# EAGLE schematic bms_slave (EAGLE 7.5.0)
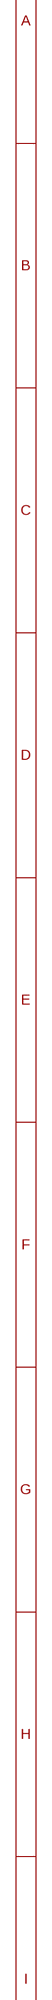
[diagram p0: schematic, sheet 1, part 1 of 2]
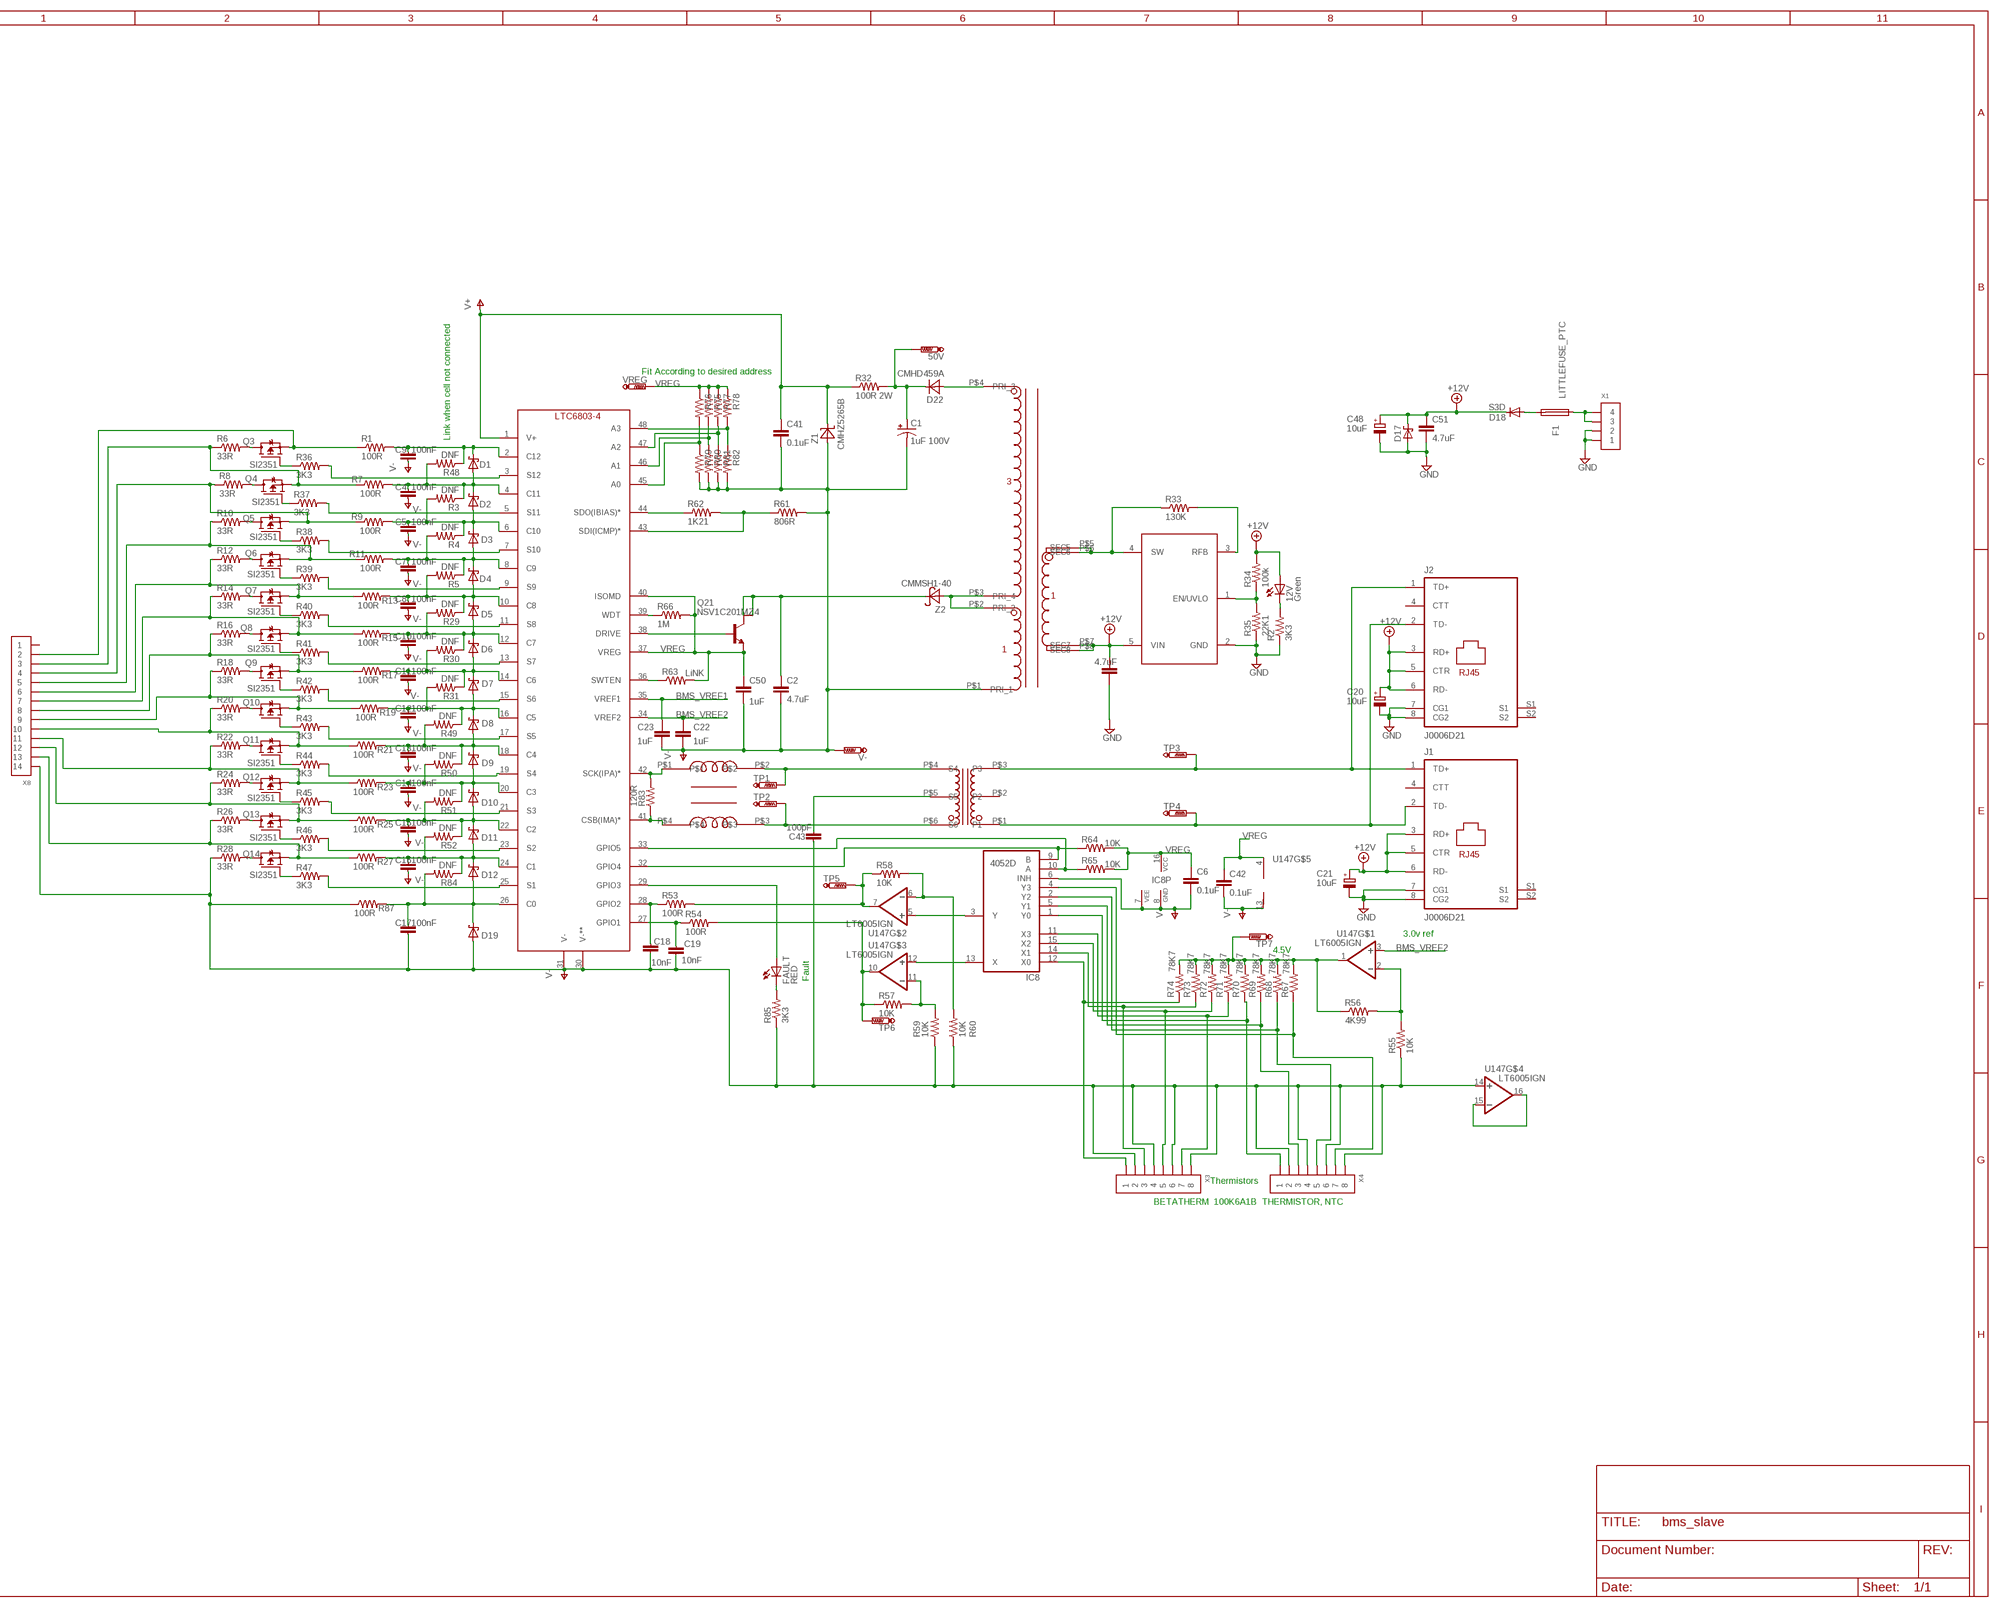
[diagram p1: schematic, sheet 1, part 2 of 2]

## Parts
12V  Green  LEDCHIP-LED0805  [CHIP-LED0805]
50V  PTR1PAD1-13  [P1-13]
C1  1uF 100V  CPOL-USSMCD  [SMC_D]
C2  4.7uF  C-EUC1206  [C1206]
C3  4.7uF  C-EUC1206  [C1206]
C4  100nF  C-EU-SMALL_0603  [C0603@1]
C5  100nF  C-EU-SMALL_0603  [C0603@1]
C6  0.1uF  C-EUC1206  [C1206]
C7  100nF  C-EU-SMALL_0603  [C0603@1]
C8  100nF  C-EU-SMALL_0603  [C0603@1]
C9  100nF  C-EU-SMALL_0603  [C0603@1]
C10  100nF  C-EU-SMALL_0603  [C0603@1]
C11  100nF  C-EU-SMALL_0603  [C0603@1]
C12  100nF  C-EU-SMALL_0603  [C0603@1]
C13  100nF  C-EU-SMALL_0603  [C0603@1]
C14  100nF  C-EU-SMALL_0603  [C0603@1]
C15  100nF  C-EU-SMALL_0603  [C0603@1]
C16  100nF  C-EU-SMALL_0603  [C0603@1]
C17  100nF  C-EU-SMALL_0603  [C0603@1]
C18  10nF  C-EU-SMALL_0603  [C0603@1]
C19  10nF  C-EU-SMALL_0603  [C0603@1]
C20  10uF  CPOL-EUSMCD  [SMC_D]
C21  10uF  CPOL-EUSMCD  [SMC_D]
C22  1uF  C-EUC1206  [C1206]
C23  1uF  C-EUC1206  [C1206]
C41  0.1uF  C-EUC1206  [C1206]
C42  0.1uF  C-EUC1206  [C1206]
C43  100pF  C-EU-SMALL  [C1206@1]
C48  10uF  CPOL-EUSMCD  [SMC_D]
C50  1uF  C-EUC1206  [C1206]
C51  4.7uF  C-EUC1206  [C1206]
D1  SMF5.0AT1  [SOD123FL]
D2  SMF5.0AT1  [SOD123FL]
D3  SMF5.0AT1  [SOD123FL]
D4  SMF5.0AT1  [SOD123FL]
D5  SMF5.0AT1  [SOD123FL]
D6  SMF5.0AT1  [SOD123FL]
D7  SMF5.0AT1  [SOD123FL]
D8  SMF5.0AT1  [SOD123FL]
D9  SMF5.0AT1  [SOD123FL]
D10  SMF5.0AT1  [SOD123FL]
D11  SMF5.0AT1  [SOD123FL]
D12  SMF5.0AT1  [SOD123FL]
D17  SCHOTTKY-DIODESMC  [SMC]
D18  S3D  DIODE-SMC  [SMC]
D19  SMF5.0AT1  [SOD123FL]
D22  CMHD459A  [SOD123]
F1  LITTLEFUSE_PTC  [1812]
FAULT  RED  LEDCHIP-LED0805  [CHIP-LED0805]
IC8  4052D  [SO16]
J1  J0006D21  [J0-C/D/E]
J2  J0006D21  [J0-C/D/E]
Q3  SI2351  [SOT23]
Q4  SI2351  [SOT23]
Q5  SI2351  [SOT23]
Q6  SI2351  [SOT23]
Q7  SI2351  [SOT23]
Q8  SI2351  [SOT23]
Q9  SI2351  [SOT23]
Q10  SI2351  [SOT23]
Q11  SI2351  [SOT23]
Q12  SI2351  [SOT23]
Q13  SI2351  [SOT23]
Q14  SI2351  [SOT23]
Q21  NSV1C201MZ4  [SOT223]
R1  100R  R-US_R0603  [R0603]
R2  3K3  R-US_R0603  [R0603]
R3  DNF  R-US_R0603  [R0603]
R4  DNF  R-US_R0603  [R0603]
R5  DNF  R-US_R0603  [R0603]
R6  33R  R-US_R2512  [R2512]
R7  100R  R-US_R0603  [R0603]
R8  33R  R-US_R2512  [R2512]
R9  100R  R-US_R0603  [R0603]
R10  33R  R-US_R2512  [R2512]
R11  100R  R-US_R0603  [R0603]
R12  33R  R-US_R2512  [R2512]
R13  100R  R-US_R0603  [R0603]
R14  33R  R-US_R2512  [R2512]
R15  100R  R-US_R0603  [R0603]
R16  33R  R-US_R2512  [R2512]
R17  100R  R-US_R0603  [R0603]
R18  33R  R-US_R2512  [R2512]
R19  100R  R-US_R0603  [R0603]
R20  33R  R-US_R2512  [R2512]
R21  100R  R-US_R0603  [R0603]
R22  33R  R-US_R2512  [R2512]
R23  100R  R-US_R0603  [R0603]
R24  33R  R-US_R2512  [R2512]
R25  100R  R-US_R0603  [R0603]
R26  33R  R-US_R2512  [R2512]
R27  100R  R-US_R0603  [R0603]
R28  33R  R-US_R2512  [R2512]
R29  DNF  R-US_R0603  [R0603]
R30  DNF  R-US_R0603  [R0603]
R31  DNF  R-US_R0603  [R0603]
R32  100R 2W  R-US_R2512  [R2512]
R33  130K  R-US_R0603  [R0603]
R34  100k  R-US_R0603  [R0603]
R35  22K1  R-US_R0603  [R0603]
R36  3K3  R-US_R0603  [R0603]
R37  3K3  R-US_R0603  [R0603]
R38  3K3  R-US_R0603  [R0603]
R39  3K3  R-US_R0603  [R0603]
R40  3K3  R-US_R0603  [R0603]
R41  3K3  R-US_R0603  [R0603]
R42  3K3  R-US_R0603  [R0603]
R43  3K3  R-US_R0603  [R0603]
R44  3K3  R-US_R0603  [R0603]
R45  3K3  R-US_R0603  [R0603]
R46  3K3  R-US_R0603  [R0603]
R47  3K3  R-US_R0603  [R0603]
R48  DNF  R-US_R0603  [R0603]
R49  DNF  R-US_R0603  [R0603]
R50  DNF  R-US_R0603  [R0603]
R51  DNF  R-US_R0603  [R0603]
R52  DNF  R-US_R0603  [R0603]
R53  100R  R-US_R0603  [R0603]
R54  100R  R-US_R0603  [R0603]
R55  10K  R-US_R0603  [R0603]
R56  4K99  R-US_R0603  [R0603]
R57  10K  R-US_R0603  [R0603]
R58  10K  R-US_R0603  [R0603]
R59  10K  R-US_R0603  [R0603]
R60  10K  R-US_R0603  [R0603]
R61  806R  R-US_R0603  [R0603]
R62  1K21  R-US_R0603  [R0603]
R63  LiNK  R-US_R0603  [R0603]
R64  10K  R-US_R0603  [R0603]
R65  10K  R-US_R0603  [R0603]
R66  1M  R-US_R0603  [R0603]
R67  78K7  R-US_R0603  [R0603]
R68  78K7  R-US_R0603  [R0603]
R69  78K7  R-US_R0603  [R0603]
R70  78K7  R-US_R0603  [R0603]
R71  78K7  R-US_R0603  [R0603]
R72  78K7  R-US_R0603  [R0603]
R73  78K7  R-US_R0603  [R0603]
R74  78K7  R-US_R0603  [R0603]
R75  R-US_R0603  [R0603]
R76  R-US_R0603  [R0603]
R77  R-US_R0603  [R0603]
R78  R-US_R0603  [R0603]
R79  R-US_R0603  [R0603]
R80  R-US_R0603  [R0603]
R81  R-US_R0603  [R0603]
R82  R-US_R0603  [R0603]
R83  120R  R-US_R0603  [R0603]
R84  DNF  R-US_R0603  [R0603]
R85  3K3  R-US_R0603  [R0603]
R87  100R  R-US_R0603  [R0603]
TP1  PTR1PAD1-13  [P1-13]
TP2  PTR1PAD1-13  [P1-13]
TP3  PTR1PAD1-13  [P1-13]
TP4  PTR1PAD1-13  [P1-13]
TP5  PTR1PAD1-13  [P1-13]
TP6  PTR1PAD1-13  [P1-13]
TP7  PTR1PAD1-13  [P1-13]
U1  LTC6804-2  [SSOP48]
U21  LT8300  [TSOT23-5]
U147  LT6005IGN  [TSSOP16]
U$1  DLW43SH510XK2  [DLW43S]
U$3  T3001NL  [T3001NL]
U$15  WURTH_750370040  [WE_750370040]
V-  PTR1PAD1-13  [P1-13]
VREG  PTR1PAD1-13  [P1-13]
X1  CONN_4-1-53261  [PB-53261-04]
X3  CONN_8-1-53261  [PB-53261-08]
X4  CONN_8-1-53261  [PB-53261-08]
X8  CONN_14-1-53261  [PB-53261-14]
Z1  CMHZ5265B  [SOD123]
Z2  CMMSH1-40  [SOD123]

## Nets
+12V [POWER_12V]: 12V.A C3.1 C20.+ C21.+ C48.+ C51.1 D17.C D18.C J1.3(RD+) J1.5(CTR) J1.6(RD-) J2.3(RD+) J2.5(CTR) J2.6(RD-) R34.2 U21.5(VIN) U$15.P$7(SEC7) U$15.P$8(SEC8)
A0: R76.2 R79.1 U1.45(A0)
A2: R77.2 R81.1 U1.47(A2)
BMS_VREF1: C23.1 U1.35(VREF1)
BMS_VREF2: C22.1 U1.34(VREF2) U147.3(+IN)
GND [GND]: C3.2 C20.- C21.- C48.- C51.2 D17.A J1.7(CG1) J1.8(CG2) J2.7(CG1) J2.8(CG2) R2.1 R35.1 U21.2(GND) X1.1 X1.2
N$1: Q14.3(D) R28.2
N$2: 12V.C R2.2
N$3: C4.1 D1.A D2.C R3.1 R7.2 R48.2 U1.4(C11)
N$4: Q21.1(B) U1.38(DRIVE)
N$5: R37.2 U1.5(S11)
N$6: J1.1(TD+) J2.1(TD+) TP3.TP U$3.P$3(P3)
N$7: Q13.3(D) R26.2
N$8: R45.2 U1.21(S3)
N$9: J1.2(TD-) J2.2(TD-) TP4.TP U$3.P$1(P1)
N$11: R55.2 R56.2 U147.2(-IN)
N$12: R83.2 U1.42(SCK(IPA)*) U$1.P$1
N$13: C5.1 D2.A D3.C R3.2 R4.1 R9.2 U1.6(C10)
N$14: C9.1 D1.C R1.2 R48.1 U1.2(C12)
N$15: Q11.3(D) R22.2
N$16: C7.1 D3.A D4.C R4.2 R5.1 R11.2 U1.8(C9)
N$17 [V-+5]: Q10.2(S) R18.1 R19.1 X8.9
N$18: FAULT.A U1.29(GPIO3)
N$19: Q3.3(D) R6.2
N$20: C8.1 D4.A D5.C R5.2 R13.2 R29.1 U1.10(C8)
N$21: R46.2 U1.23(S2)
N$22: R78.2 R82.1 U1.48(A3)
N$23: Q4.3(D) R8.2
N$24: C10.1 D5.A D6.C R15.2 R29.2 R30.1 U1.12(C7)
N$25: FAULT.C R85.2
N$27: Q5.3(D) R10.2
N$28: C11.1 D6.A D7.C R17.2 R30.2 R31.1 U1.14(C6)
N$29: C43.1 U$3.P$5(S5)
N$30: R36.2 U1.3(S12)
N$31: Q6.3(D) R12.2
N$32: C12.1 D7.A D8.C R19.2 R31.2 R49.1 U1.16(C5)
N$34: R38.2 U1.7(S10)
N$35: Q7.3(D) R14.2
N$36: C13.1 D8.A D9.C R21.2 R49.2 R50.1 U1.18(C4)
N$37: R39.2 U1.9(S9)
N$38: R40.2 U1.11(S8)
N$39: Q8.3(D) R16.2
N$40: C14.1 D9.A D10.C R23.2 R50.2 R51.1 U1.20(C3)
N$41: R41.2 U1.13(S7)
N$42: R42.2 U1.15(S6)
N$43: Q9.3(D) R18.2
N$44: C15.1 D10.A D11.C R25.2 R51.2 R52.1 U1.22(C2)
N$45: Q10.3(D) R20.2
N$46: R43.2 U1.17(S5)
N$47: D18.A F1.P$2
N$48: C16.1 D11.A D12.C R27.2 R52.2 R84.1 U1.24(C1)
N$49: R58.2 R60.2 U147.6(-IN)
N$50: TP2.TP U$1.P$3 U$3.P$6(S6)
N$51: TP1.TP U$1.P$2 U$3.P$4(S4)
N$52: 50V.TP C1.+ D22.C R32.2
N$53: R75.2 R80.1 U1.46(A1)
N$54: F1.P$1 X1.3 X1.4
N$56: C2.1 Q21.2(C2) Q21.4(C4) Z2.C
N$57: Q4.2(S) R6.1 R7.1 X8.3
N$59: Q5.2(S) R8.1 R9.1 X8.4
N$64: D22.A U$15.P$4(PRI_3)
N$65 [V-+6]: Q9.2(S) R16.1 R17.1 X8.8
N$66 [V-+7]: Q8.2(S) R14.1 R15.1 X8.7
N$67: U$15.P$2(PRI_2) U$15.P$3(PRI_4) Z2.A
N$68 [V-+4]: Q11.2(S) R20.1 R21.1 X8.10
N$69 [V-+3]: Q12.2(S) R22.1 R23.1 X8.11
N$70: R33.1 U21.4(SW) U$15.P$5(SEC5) U$15.P$6(SEC6)
N$71 [V-+2]: Q13.2(S) R24.1 R25.1 X8.12
N$72 [V-+1]: Q14.2(S) R26.1 R27.1 X8.13
N$74: R44.2 U1.19(S4)
N$75: R33.2 U21.3(RFB)
N$76: R34.1 R35.2 U21.1(EN/UVLO)
N$77: C17.1 D12.A D19.C R84.2 R87.2 U1.26(C0)
N$78: Q14.1(G) R47.1
N$79: Q13.1(G) R46.1
N$80: Q12.1(G) R45.1
N$81: Q11.1(G) R44.1
N$82: Q10.1(G) R43.1
N$83: Q9.1(G) R42.1
N$84: Q8.1(G) R41.1
N$85: Q7.1(G) R40.1
N$86: Q6.1(G) R39.1
N$87: Q5.1(G) R38.1
N$88: Q4.1(G) R37.1
N$89: Q3.2(S) R1.1 X8.2
N$90: Q3.1(G) R36.1
N$92: R83.1 U1.41(CSB(IMA)*) U$1.P$4
N$96: IC8.3(Y) U147.5(+IN)
N$97: R53.2 R58.1 TP5.TP U147.7(OUT)
N$98: R54.2 R57.1 TP6.TP U147.10(OUT)
N$99: IC8.13(X) U147.12(+IN)
N$100: C19.1 R54.1 U1.27(GPIO1)
N$101: C18.1 R53.1 U1.28(GPIO2)
N$102: IC8.9(B) R64.1 U1.32(GPIO4)
N$103: IC8.10(A) R65.1 U1.33(GPIO5)
N$104: R57.2 R59.2 U147.11(-IN)
N$105: R62.1 U1.44(SDO(IBIAS)*)
N$106: R61.1 R62.2 U1.43(SDI(ICMP)*)
N$107: R63.1 U1.36(SWTEN)
N$109: R66.1 U1.39(WDT)
N$112: Q6.2(S) R10.1 R11.1 X8.5
N$117 [V-+8]: Q7.2(S) R12.1 R13.1 X8.6
N$145: U147.15(-IN) U147.16(OUT)
N$178: R56.1 R67.2 R68.2 R69.2 R70.2 R71.2 R72.2 R73.2 R74.2 TP7.TP U147.1(OUT)
N$180: IC8.12(X0) R74.1 X3.1
N$181: IC8.14(X1) R73.1 X3.3
N$182: IC8.15(X2) R72.1 X3.5
N$183: IC8.11(X3) R71.1 X3.7
N$184: IC8.1(Y0) R70.1 X4.1
N$185: IC8.5(Y1) R69.1 X4.3
N$186: IC8.2(Y2) R68.1 X4.5
N$187: IC8.4(Y3) R67.1 X4.7
N$199: R47.2 U1.25(S1)
Q12: Q12.3(D) R24.2
V+: C41.1 R32.1 U1.1(V+) Z1.C
V- [BMS V-]: C1.- C2.2 C4.2 C5.2 C6.2 C7.2 C8.2 C9.2 C10.2 C11.2 C12.2 C13.2 C14.2 C15.2 C16.2 C17.2 C18.2 C19.2 C22.2 C23.2 C41.2 C42.2 C43.2 C50.2 D19.A IC8.6(INH) IC8.7(VEE) IC8.8(GND) R28.1 R55.1 R59.1 R60.1 R61.2 R79.2 R80.2 R81.2 R82.2 R85.1 R87.1 U1.30(V-**) U1.31(V-) U147.13(V-) U147.14(+IN) U$15.P$1(PRI_1) V-.TP X3.2 X3.4 X3.6 X3.8 X4.2 X4.4 X4.6 X4.8 X8.14 Z1.A
VREG: C6.1 C42.1 C50.1 IC8.16(VCC) Q21.3(E) R63.2 R64.2 R65.2 R66.2 R75.1 R76.1 R77.1 R78.1 U1.37(VREG) U1.40(ISOMD) U147.4(V+) VREG.TP
Unconnected: J1.4(CTT) J1.S1 J1.S2 J2.4(CTT) J2.S1 J2.S2 U147.8(NC) U147.9(NC) U$3.P$2(P2) X8.1

## Notes on the sheet
- Fit According to desired address
- Link when cell not connected
- 3.0v ref
- 4.5V
- Fault
- Thermistors
- BETATHERM  100K6A1B  THERMISTOR, NTC

## Library data of the parts
12V FAULT = led:LED: LED OSRAM: - CHIPLED LG R971, LG N971, LY N971, LG Q971, LY Q971, LO R971, LY R971 LH N974, LH R974 LS Q976, LO Q976, LY Q976 LO Q996 - Hyper CHIPLED LW Q18S LB Q993, LB Q99A, LB R99A - SideLED LS A670, LO A670, LY A670, LG A670, LP A670 LB A673, LV A673, LT A673, LW A673 LH A674 LY A675 LS A676, LA A676, LO A676, LY A676, LW A676 LS A679, LY A679, LG A679 - Hyper Micro SIDELED® LS Y876, LA Y876, LO Y876, LY Y876 LT Y87S - SmartLED LW L88C, LW L88S LB L89C, LB L89S, LG L890 LS L89K, LO L89K, LY L89K LS L896, LA L896, LO L896, LY L896 - TOPLED LS T670, LO T670, LY T670, LG T670, LP T670 LSG T670, LSP T670, LSY T670, LOP T670, LYG T670 LG T671, LOG T671, LSG T671 LB T673, LV T673, LT T673, LW T673 LH T674 LS T676, LA T676, LO T676, LY T676, LB T676, LH T676, LSB T676, LW T676 LB T67C, LV T67C, LT T67C, LS T67K, LO T67K, LY T67K, LW E67C LS E67B, LA E67B, LO E67B, LY E67B, LB E67C, LV E67C, LT E67C LW T67C LS T679, LY T679, LG T679 LS T770, LO T770, LY T770, LG T770, LP T770 LB T773, LV T773, LT T773, LW T773 LH T774 LS E675, LA E675, LY E675, LS T675 LS T776, LA T776, LO T776, LY T776, LB T776 LHGB T686 LT T68C, LB T68C - Hyper Mini TOPLED® LB M676 - Mini TOPLED Santana® LG M470 LS M47K, LO M47K, LY M47K Source: http://www.osram.convergy.de LUXEON: - LUMILED® LXK2-PW12-R00, LXK2-PW12-S00, LXK2-PW14-U00, LXK2-PW14-V00 LXK2-PM12-R00, LXK2-PM12-S00, LXK2-PM14-U00 LXK2-PE12-Q00, LXK2-PE12-R00, LXK2-PE12-S00, LXK2-PE14-T00, LXK2-PE14-U00 LXK2-PB12-K00, LXK2-PB12-L00, LXK2-PB12-M00, LXK2-PB14-N00, LXK2-PB14-P00, LXK2-PB14-Q00 LXK2-PR12-L00, LXK2-PR12-M00, LXK2-PR14-Q00, LXK2-PR14-R00 LXK2-PD12-Q00, LXK2-PD12-R00, LXK2-PD12-S00 LXK2-PH12-R00, LXK2-PH12-S00 LXK2-PL12-P00, LXK2-PL12-Q00, LXK2-PL12-R00 Source: www.luxeon.com KINGBRIGHT: KA-3528ASYC Source: www.kingbright.com
50V TP1-TP7 V- VREG = testpad:PTR1: TEST PIN
C1 = rcl:CPOL-US: POLARIZED CAPACITOR, American symbol
C2 C3 C6 C22 C23 C41 C42 C50 C51 = rcl:C-EU: CAPACITOR, European symbol
C4 C5 C7-C19 = rcl:C-EU-SMALL_0603
C20 C21 C48 = rcl:CPOL-EU: POLARIZED CAPACITOR, European symbol
C43 = rcl:C-EU-SMALL
D1-D12 D19 = diode:SMF5.0AT1: 200 W Transient Voltage Suppressor Source: Data sheet <http://www.onsemi.com/pub_link/Collateral/SMF5.0AT1-D.PDF>
D17 = diode:SCHOTTKY-DIODE: Schottky Diode
D18 = diode:DIODE-: DIODE
D22 = diode:CMHD459A
F1 = fuse:LITTLEFUSE_PTC
IC8 = 40xx:4052: Dual 4-channel ANALOG MULTIPLEXER
J1 J2 = pulse-eng:J0006D21: RJ45 PulseJack
Q3-Q14 = transistor-fet:SI2351
Q21 = transistor-npn:NSV1C201MZ4
R1-R85 R87 = rcl:R-US_: RESISTOR, American symbol
U1 = linear-technology:LTC6804-2
U21 = linear-technology:LT8300
U147 = linear-technology:LT6005IGN
U$1 = murata-filter:DLW43SH510XK2
U$3 = pulse-eng:T3001NL
U$15 = WE-FB_LT3573:WURTH_750370040
X1 = molex_clik-mate:CONN_4-1
X3 X4 = molex_clik-mate:CONN_8-1
X8 = molex_clik-mate:CONN_14-1
Z1 = diode:CMHZ5265B
Z2 = diode:CMMSH1-40

## Net classes
0 default: drill 0.305 mm, clearance 0.152 mm
1 POWER_12V: width 0.61 mm, drill 0.305 mm, clearance 0.254 mm to class 0, clearance 0.152 mm
2 POWER_5V: width 0.61 mm, drill 0.305 mm, clearance 0.254 mm to class 0, clearance 0.254 mm to class 1, clearance 0.152 mm
3 BMS V-: width 0.254 mm, drill 0.305 mm, clearance 0.152 mm to class 0, clearance 2 mm to class 1, clearance 2 mm to class 2, clearance 0.152 mm
4 V-+1: width 0.254 mm, drill 0.305 mm, clearance 0.152 mm to class 0, clearance 2 mm to class 1, clearance 2 mm to class 2, clearance 0.152 mm to class 3, clearance 0.152 mm
5 V-+2: width 0.254 mm, drill 0.305 mm, clearance 0.152 mm to class 0, clearance 2 mm to class 1, clearance 2 mm to class 2, clearance 0.33 mm to class 3, clearance 0.152 mm to class 4, clearance 0.152 mm
6 V-+3: width 0.254 mm, drill 0.305 mm, clearance 0.152 mm to class 0, clearance 2 mm to class 1, clearance 2 mm to class 2, clearance 0.356 mm to class 3, clearance 0.33 mm to class 4, clearance 0.152 mm to class 5, clearance 0.152 mm
7 V-+4: width 0.254 mm, drill 0.305 mm, clearance 0.152 mm to class 0, clearance 2 mm to class 1, clearance 2 mm to class 2, clearance 0.381 mm to class 3, clearance 0.356 mm to class 4, clearance 0.33 mm to class 5, clearance 0.152 mm to class 6, clearance 0.152 mm
8 V-+5: width 0.254 mm, drill 0.305 mm, clearance 0.152 mm to class 0, clearance 2 mm to class 1, clearance 2 mm to class 2, clearance 0.406 mm to class 3, clearance 0.381 mm to class 4, clearance 0.356 mm to class 5, clearance 0.33 mm to class 6, clearance 0.152 mm to class 7, clearance 0.152 mm
9 V-+6: width 0.254 mm, drill 0.305 mm, clearance 0.152 mm to class 0, clearance 2 mm to class 1, clearance 2 mm to class 2, clearance 0.432 mm to class 3, clearance 0.406 mm to class 4, clearance 0.381 mm to class 5, clearance 0.356 mm to class 6, clearance 0.33 mm to class 7, clearance 0.152 mm to class 8, clearance 0.152 mm
10 V-+7: width 0.254 mm, drill 0.305 mm, clearance 0.152 mm to class 0, clearance 2 mm to class 1, clearance 2 mm to class 2, clearance 0.457 mm to class 3, clearance 0.432 mm to class 4, clearance 0.406 mm to class 5, clearance 0.381 mm to class 6, clearance 0.356 mm to class 7, clearance 0.33 mm to class 8, clearance 0.152 mm to class 9, clearance 0.152 mm
11 V-+8: width 0.254 mm, drill 0.305 mm, clearance 0.152 mm to class 0, clearance 2 mm to class 1, clearance 2 mm to class 2, clearance 0.483 mm to class 3, clearance 0.457 mm to class 4, clearance 0.432 mm to class 5, clearance 0.406 mm to class 6, clearance 0.381 mm to class 7, clearance 0.356 mm to class 8, clearance 0.33 mm to class 9, clearance 0.152 mm to class 10, clearance 0.152 mm
12 GND: width 0.406 mm, drill 0.305 mm, clearance 0.3 mm to class 0, clearance 0.381 mm to class 1, clearance 0.381 mm to class 2, clearance 0.483 mm to class 3, clearance 0.457 mm to class 4, clearance 0.432 mm to class 5, clearance 0.406 mm to class 6, clearance 0.381 mm to class 7, clearance 0.356 mm to class 8, clearance 0.33 mm to class 9, clearance 0.152 mm to class 10, clearance 0.152 mm to class 11, clearance 0.152 mm